# EAGLE design TSAL_mainboard (EAGLE 9.6.2)
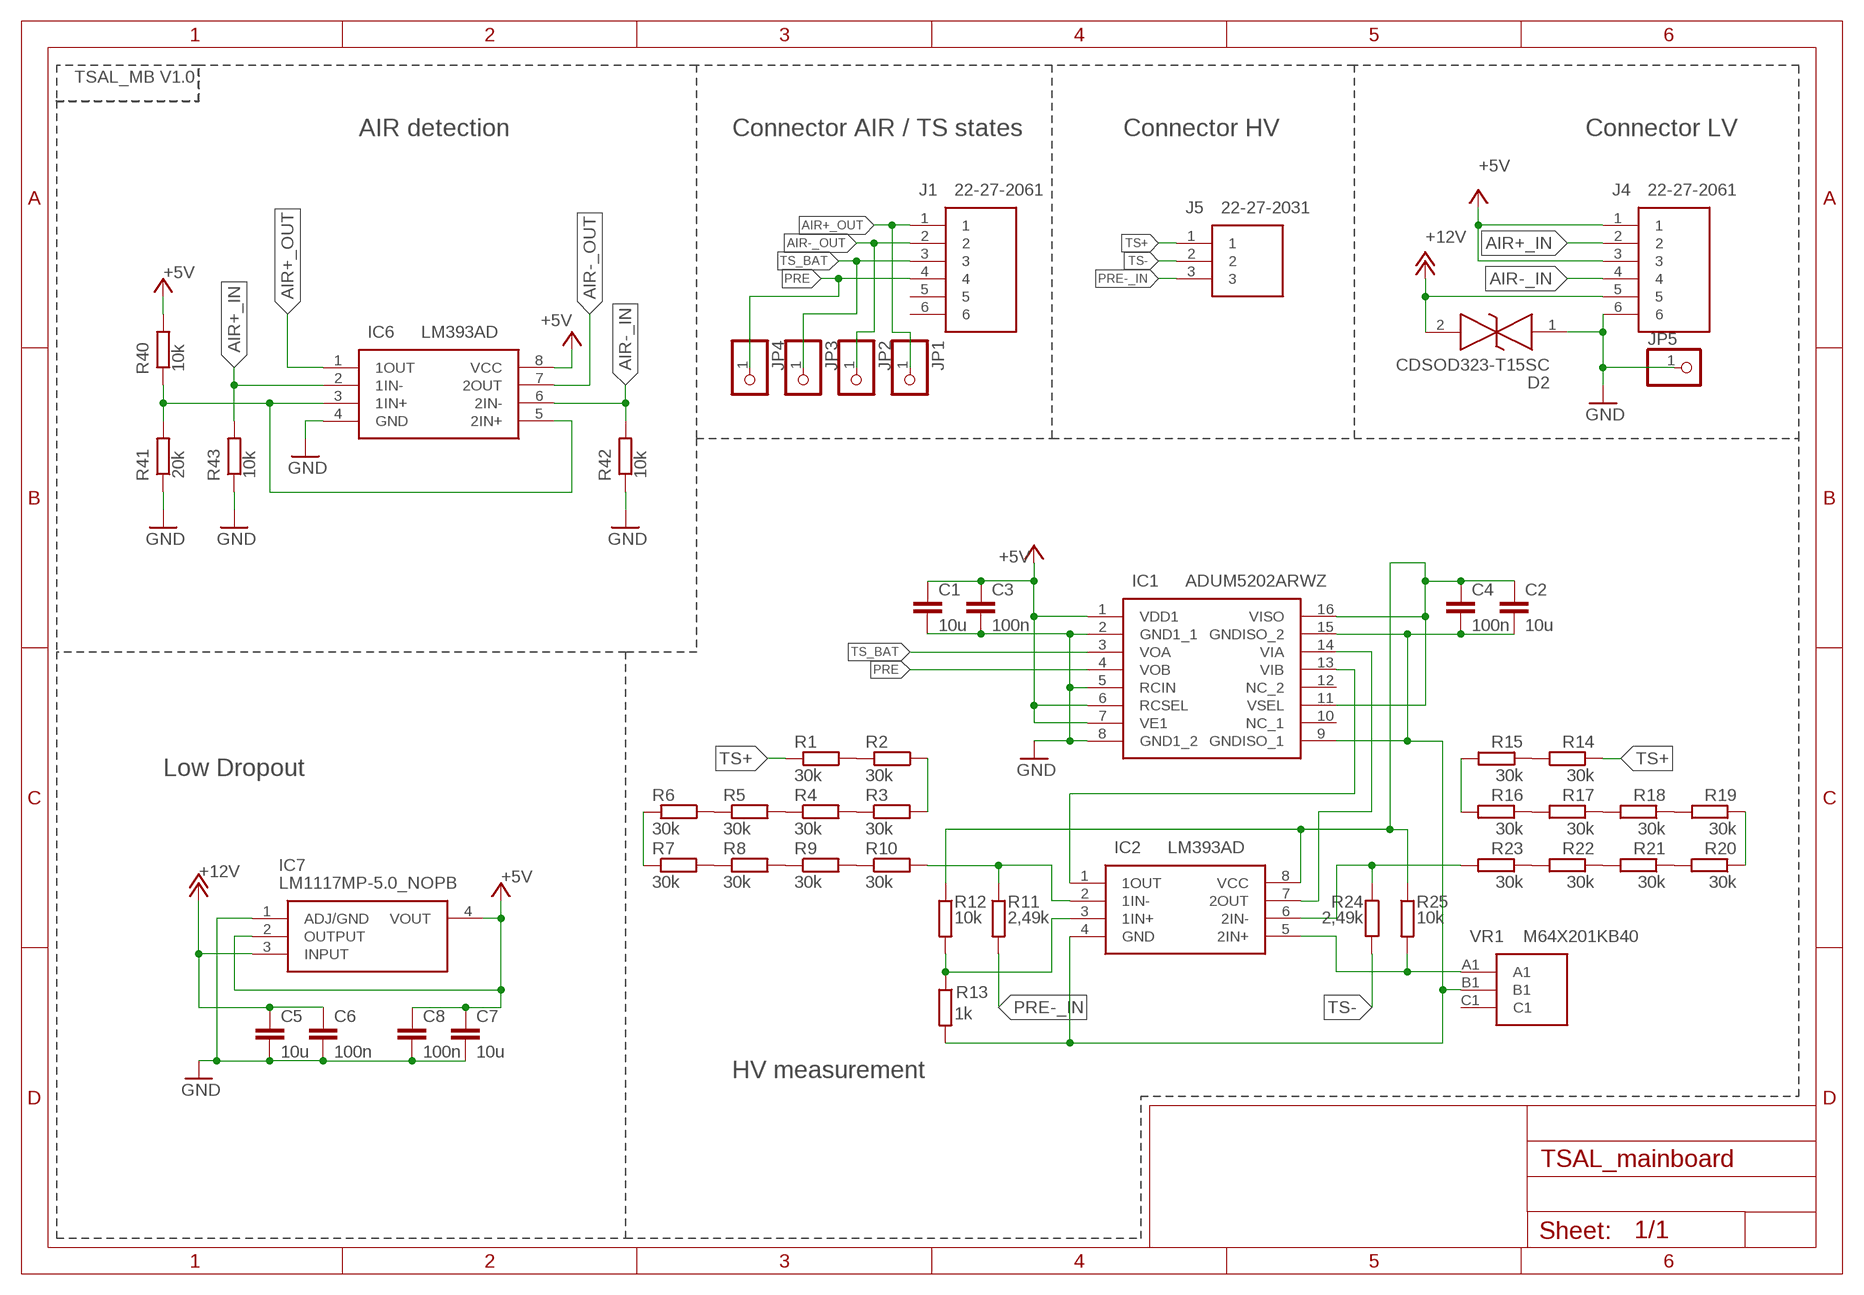
[diagram p0: schematic, sheet 1]

## Parts
C1  10u  C-EUC1206  [C1206]
C2  10u  C-EUC1206  [C1206]
C3  100n  C-EUC0603  [C0603]
C4  100n  C-EUC0603  [C0603]
C5  10u  C-EUC1206  [C1206]
C6  100n  C-EUC0603  [C0603]
C7  10u  C-EUC1206  [C1206]
C8  100n  C-EUC0603  [C0603]
D2  CDSOD323-T15SC  [SOD-323]
IC1  ADUM5202ARWZ  [SOIC127P1032X265-16N]
IC2  LM393AD  [SOIC127P600X175-8N]
IC6  LM393AD  [SOIC127P600X175-8N]
IC7  LM1117MP-5.0_NOPB  [SOT230P700X180-4N]
J1  22-27-2061  [HDRV6W64P0X254_1X6_1524X580X11]
J4  22-27-2061  [HDRV6W64P0X254_1X6_1524X580X11]
J5  22-27-2031  [SHDR3W64P0X254_1X3_762X580X111]
JP1  PINHD-1X1  [1X01]
JP2  PINHD-1X1  [1X01]
JP3  PINHD-1X1  [1X01]
JP4  PINHD-1X1  [1X01]
JP5  PINHD-1X1  [1X01]
R1  30k  R-EU_R1206  [R1206]
R2  30k  R-EU_R1206  [R1206]
R3  30k  R-EU_R1206  [R1206]
R4  30k  R-EU_R1206  [R1206]
R5  30k  R-EU_R1206  [R1206]
R6  30k  R-EU_R1206  [R1206]
R7  30k  R-EU_R1206  [R1206]
R8  30k  R-EU_R1206  [R1206]
R9  30k  R-EU_R1206  [R1206]
R10  30k  R-EU_R1206  [R1206]
R11  2,49k  R-EU_R0603  [R0603]
R12  10k  R-EU_R0603  [R0603]
R13  1k  R-EU_R1206  [R1206]
R14  30k  R-EU_R1206  [R1206]
R15  30k  R-EU_R1206  [R1206]
R16  30k  R-EU_R1206  [R1206]
R17  30k  R-EU_R1206  [R1206]
R18  30k  R-EU_R1206  [R1206]
R19  30k  R-EU_R1206  [R1206]
R20  30k  R-EU_R1206  [R1206]
R21  30k  R-EU_R1206  [R1206]
R22  30k  R-EU_R1206  [R1206]
R23  30k  R-EU_R1206  [R1206]
R24  2,49k  R-EU_R0603  [R0603]
R25  10k  R-EU_R0603  [R0603]
R40  10k  R-EU_R0603  [R0603]
R41  20k  R-EU_R0603  [R0603]
R42  10k  R-EU_R0603  [R0603]
R43  10k  R-EU_R0603  [R0603]
VR1  M64X201KB40  [M64X201KB40]

## Nets
+5V [5V]: C1.1 C3.1 C7.1 C8.1 IC1.1(VDD1) IC1.6(RCSEL) IC1.7(VE1) IC6.8(VCC) IC7.2(OUTPUT) IC7.4(VOUT) J4.1 J4.3 R40.2
+12V [12V]: C5.1 C6.1 D2.2 IC7.3(INPUT) J4.5
AIR+_IN [5V]: IC6.2(1IN-) J4.2 R43.2
AIR+_OUT [5V]: IC6.1(1OUT) J1.1 JP1.1
AIR-_IN [5V]: IC6.6(2IN-) J4.4 R42.2
AIR-_OUT [5V]: IC6.7(2OUT) J1.2 JP2.1
GND [GROUND]: C1.2 C3.2 C5.2 C6.2 C7.2 C8.2 D2.1 IC1.2(GND1_1) IC1.5(RCIN) IC1.8(GND1_2) IC6.4(GND) IC7.1(ADJ/GND) J4.6 JP5.1 R41.1 R42.1 R43.1
N$2 [5V]: C2.1 C4.1 IC1.11(VSEL) IC1.16(VISO) IC2.8(VCC) R12.1 R25.1
N$3 [30V]: R1.1 R2.2
N$4 [30V]: R2.1 R3.2
N$5 [30V]: R3.1 R4.2
N$6 [30V]: R4.1 R5.2
N$7 [30V]: R6.2 R7.1
N$8 [30V]: R7.2 R8.1
N$9 [30V]: R8.2 R9.1
N$10 [30V]: R9.2 R10.1
N$11 [30V]: R5.1 R6.1
N$12 [30V]: IC2.2(1IN-) R10.2 R11.1
N$13 [5V]: IC2.3(1IN+) R12.2 R13.1
N$14 [30V]: R14.1 R15.2
N$15 [30V]: R15.1 R16.2
N$16 [30V]: R16.1 R17.2
N$17 [30V]: R17.1 R18.2
N$18 [30V]: R19.2 R20.1
N$19 [30V]: R20.2 R21.1
N$20 [30V]: R21.2 R22.1
N$21 [30V]: R22.2 R23.1
N$22 [30V]: R18.1 R19.1
N$23 [30V]: IC2.6(2IN-) R23.2 R24.1
N$24 [5V]: IC1.13(VIB) IC2.1(1OUT)
N$25 [5V]: IC2.5(2IN+) R25.2 VR1.A1
N$28 [5V]: IC1.14(VIA) IC2.7(2OUT)
N$29 [5V]: IC6.3(1IN+) IC6.5(2IN+) R40.1 R41.2
N$70 [5V]: C2.2 C4.2 IC1.9(GNDISO_1) IC1.15(GNDISO_2) IC2.4(GND) R13.2 VR1.B1
PRE [5V]: IC1.4(VOB) J1.4 JP4.1
PRE-_IN [30V]: J5.3 R11.2
TS+ [30V]: J5.1 R1.2 R14.2
TS- [30V]: J5.2 R24.2
TS_BAT [5V]: IC1.3(VOA) J1.3 JP3.1
Unconnected: IC1.10(NC_1) IC1.12(NC_2) J1.5 J1.6 VR1.C1

## Notes on the sheet
- TSAL_MB V1.0
- AIR detection | Connector AIR / TS states | Connector HV | Connector LV
- Low Dropout
- HV measurement

## Library data of the parts
C1-C8 = rcl:C-EU: CAPACITOR, European symbol; SPICEPREFIX: C
D2 = SamacSys_Parts:CDSOD323-T15SC: TVS Diode ESD 15V BiDirectional SOD323 Bourns CDSOD323-T15SC Bi-Directional TVS Diode, 400W peak, 2-Pin SOD-323 Source: Datasheet <http://uk.rs-online.com/web/p/products/7734570>; ALLIED_NUMBER: 70410859; DESCRIPTION: TVS Diode ESD 15V BiDirectional SOD323 Bourns CDSOD323-T15SC Bi-Directional TVS Diode, 400W peak, 2-Pin SOD-323; HEIGHT: mm; MANUFACTURER_NAME: Bourns; MANUFACTURER_PART_NUMBER: CDSOD323-T15SC; RS_PART_NUMBER: 7734570; RS_PRICE-STOCK: http://uk.rs-online.com/web/p/products/7734570
IC1 = SamacSys_Parts:ADUM5202ARWZ: Digital Isolator 2-channel SOIC16 Source: Datasheet <http://docs-emea.rs-online.com/webdocs/0e48/0900766b80e48186.pdf>; ARROW_PART_NUMBER: ADUM5202ARWZ; ARROW_PRICE-STOCK: https://www.arrow.com/en/products/adum5202arwz/analog-devices; DESCRIPTION: Digital Isolator 2-channel SOIC16; HEIGHT: 2.65mm; MANUFACTURER_NAME: Analog Devices; MANUFACTURER_PART_NUMBER: ADUM5202ARWZ; MOUSER_PART_NUMBER: 584-ADUM5202ARWZ; MOUSER_PRICE-STOCK: https://www.mouser.com/Search/Refine.aspx?Keyword=584-ADUM5202ARWZ
IC2 IC6 = SamacSys_Parts:LM393AD: LM393ADG4, Dual Comparator Open Collector 1.3s 2-kanalers 3, 5, 9, 12, 15, 18, 24, 28V 8-Pin SOIC Source: Datasheet <http://uk.rs-online.com/web/p/products/5171905P>; DESCRIPTION: LM393ADG4, Dual Comparator Open Collector 1.3s 2-kanalers 3, 5, 9, 12, 15, 18, 24, 28V 8-Pin SOIC; HEIGHT: 1.75mm; MANUFACTURER_NAME: Texas Instruments; MANUFACTURER_PART_NUMBER: LM393AD; RS_PART_NUMBER: 5171905P; RS_PRICE-STOCK: http://uk.rs-online.com/web/p/products/5171905P
IC7 = SamacSys_Parts:LM1117MP-5.0_NOPB: LM1117MP-5.0/NOPB, Low Dropout Voltage Regulator, 1.5A, 5 V +/-1%, 4-Pin SOT-223 Source: Datasheet <https://datasheet.datasheetarchive.com/originals/distributors/Datasheets-SFU2/DSASFU100036103.pdf>; ARROW_PART_NUMBER: LM1117MP-5.0/NOPB; ARROW_PRICE-STOCK: https://www.arrow.com/en/products/lm1117mp-5.0nopb/texas-instruments?region=nac; DESCRIPTION: LM1117MP-5.0/NOPB, Low Dropout Voltage Regulator, 1.5A, 5 V +/-1%, 4-Pin SOT-223; HEIGHT: 1.8mm; MANUFACTURER_NAME: Texas Instruments; MANUFACTURER_PART_NUMBER: LM1117MP-5.0/NOPB; MOUSER_PART_NUMBER: 926-LM1117MP-5.0NOPB; MOUSER_PRICE-STOCK: https://www.mouser.co.uk/ProductDetail/Texas-Instruments/LM1117MP-50-NOPB?qs=X1J7HmVL2ZFGlzwnAaPsKg%3D%3D
J1 J4 = SamacSys_Parts:22-27-2061: 6way straight PCB header w/friction lock Molex KK Series, Series Number 6410, 2.54mm Pitch 6 Way 1 Row Straight PCB Header, Solder Termination, 4A Source: Datasheet <http://uk.rs-online.com/web/p/products/4838506P>; DESCRIPTION: 6way straight PCB header w/friction lock Molex KK Series, Series Number 6410, 2.54mm Pitch 6 Way 1 Row Straight PCB Header, Solder Termination, 4A; HEIGHT: 11.7mm; MANUFACTURER_NAME: Molex; MANUFACTURER_PART_NUMBER: 22-27-2061; RS_PART_NUMBER: 4838506P; RS_PRICE-STOCK: http://uk.rs-online.com/web/p/products/4838506P
J5 = SamacSys_Parts:22-27-2031: 3way straight PCB header w/friction lock Molex KK Series, Series Number 6410, 2.54mm Pitch 3 Way 1 Row Straight PCB Header, Solder Termination, 4A Source: Datasheet <http://uk.rs-online.com/web/p/products/4838477P>; ALLIED_NUMBER: 70190935; DESCRIPTION: 3way straight PCB header w/friction lock Molex KK Series, Series Number 6410, 2.54mm Pitch 3 Way 1 Row Straight PCB Header, Solder Termination, 4A; HEIGHT: 11.18mm; MANUFACTURER_NAME: Molex; MANUFACTURER_PART_NUMBER: 22-27-2031; RS_PART_NUMBER: 4838477P; RS_PRICE-STOCK: http://uk.rs-online.com/web/p/products/4838477P
JP1-JP5 = pinhead:PINHD-1X1: PIN HEADER
R1-R25 R40-R43 = rcl:R-EU_: RESISTOR, European symbol; SPICEPREFIX: R
VR1 = SamacSys_Parts:M64X201KB40: Trimmer Resistors - Through Hole 3/8"SQ 200ohms Multi Turn Cermet Source: Datasheet <https://www.mouser.co.uk/datasheet/2/427/64-239937.pdf>; ARROW_PART_NUMBER: M64X201KB40; ARROW_PRICE-STOCK: https://www.arrow.com/en/products/m64x201kb40/vishay; DESCRIPTION: Trimmer Resistors - Through Hole 3/8"SQ 200ohms Multi Turn Cermet; HEIGHT: 9.8mm; MANUFACTURER_NAME: Vishay; MANUFACTURER_PART_NUMBER: M64X201KB40; MOUSER_PART_NUMBER: 594-64X201; MOUSER_PRICE-STOCK: https://www.mouser.com/Search/Refine.aspx?Keyword=594-64X201

## Net classes
1 GROUND: width 0.5 mm, drill 0.401 mm, clearance 0.051 mm
2 12V: width 0.5 mm, drill 0.401 mm, clearance 0.051 mm
3 30V: width 0.8 mm, drill 0.401 mm, clearance 0.051 mm
4 5V: width 0.3 mm, drill 0.401 mm, clearance 0.051 mm

## Board
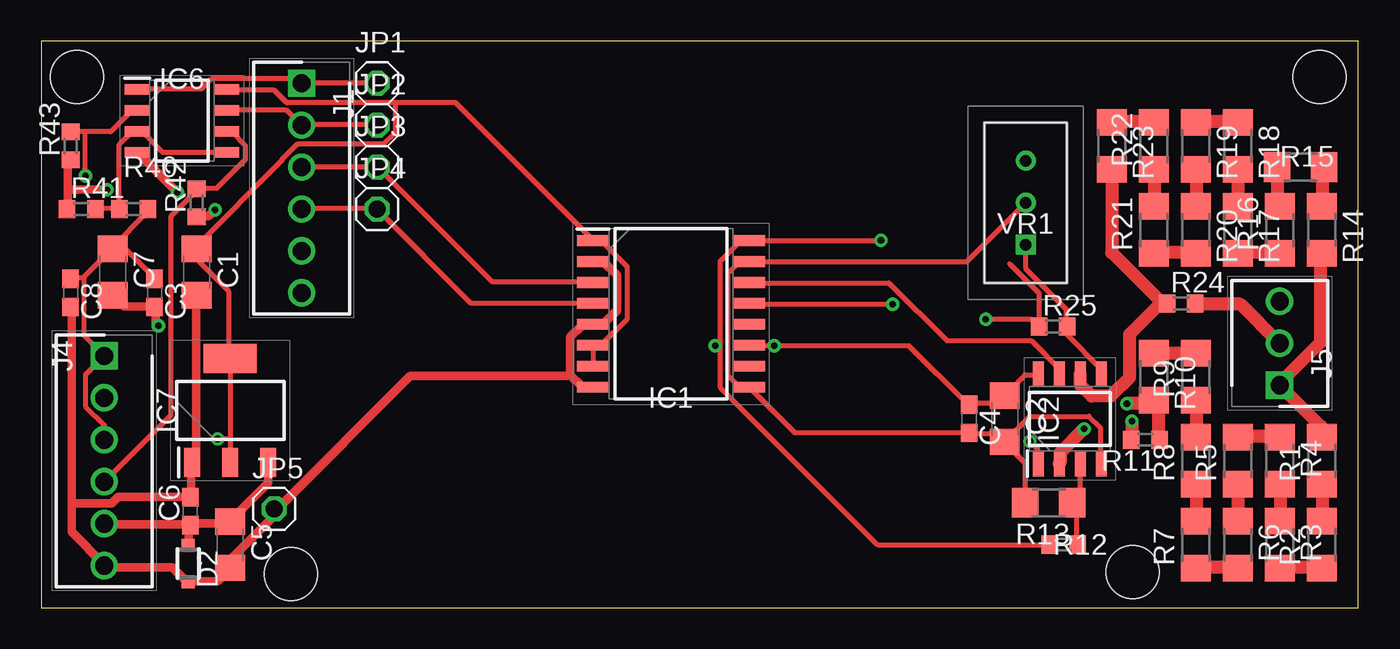
[diagram p1: board, top side]
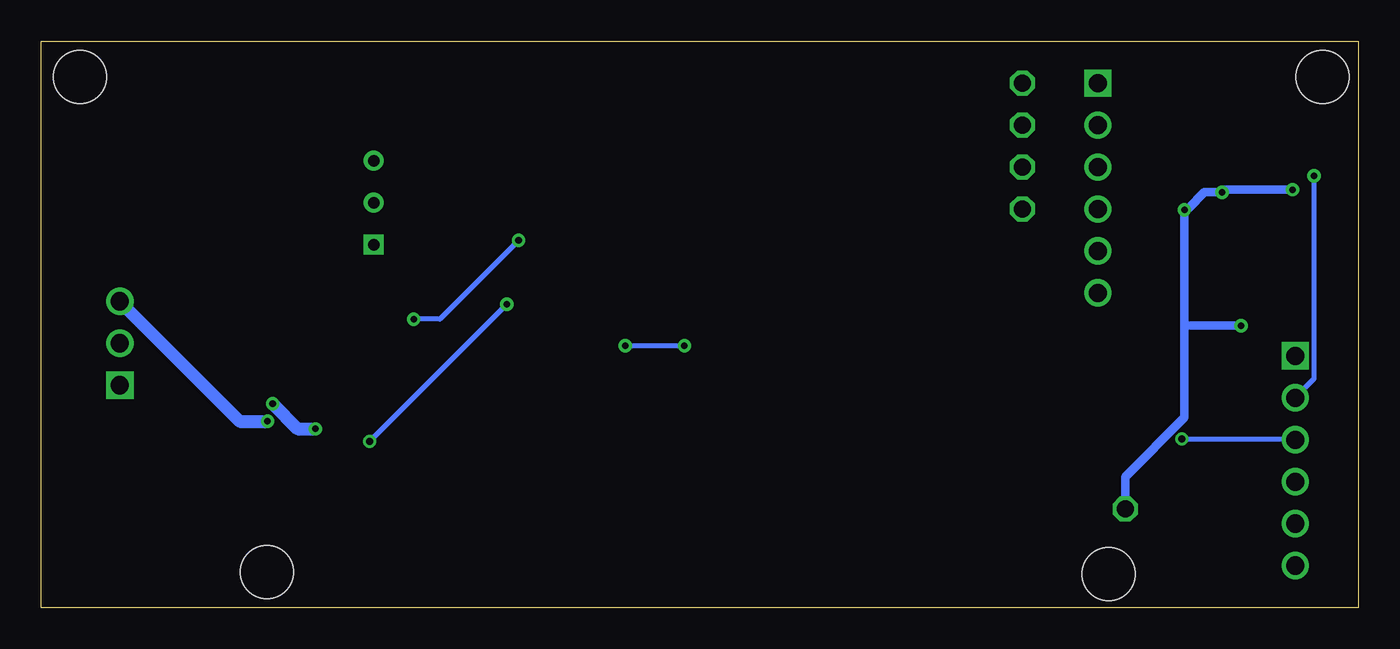
[diagram p2: board, bottom side, seen from below]

Size 79.68 x 34.28 mm. Coordinates in mm from the lower left corner, seen from the top.
Outline: 0,0 79.68,0 79.68,34.28 0,34.28 0,0
Copper layers (1*16): Top 0.035mm / dielectric 1.5mm / Bottom 0.035mm
Design rules "default": minimum track width 6mil, minimum drill 0.35mm, track to track 6mil, track to pad 6mil, pad to pad 6mil, via to via 6mil, smd to smd 6mil, copper to edge 40mil, drill to drill 6mil, minimum pad ring 10mil, minimum via ring 8mil, stop-mask expansion 4mil, vias tented up to drill 0mil, thermal gap 10mil
Holes 3.2 mm at 2.16,32.13 15.11,2.03 77.34,32.13 66.04,2.16

### Footprints (pad centres in the part's own frame; a part is rotated, then mirrored left to right if it is on the bottom)
C1206 = smd 1.6 x 1.8: 1 -1.4,0; 2 1.4,0
C0603 = smd 1.1 x 1: 1 -0.85,0; 2 0.85,0
SOD-323 = smd 0.8 x 0.8: 1 -1.1,0; 2 1.1,0
SOIC127P1032X265-16N = smd 1.925 x 0.65: 1 -4.712,4.445; 2 -4.712,3.175; 3 -4.712,1.905; 4 -4.712,0.635; 5 -4.712,-0.635; 6 -4.712,-1.905; 7 -4.712,-3.175; 8 -4.712,-4.445; 9 4.712,-4.445; 10 4.712,-3.175; 11 4.712,-1.905; 12 4.712,-0.635; 13 4.712,0.635; 14 4.712,1.905; 15 4.712,3.175; 16 4.712,4.445
SOIC127P600X175-8N = smd 1.528 x 0.65: 1 -2.711,1.905; 2 -2.711,0.635; 3 -2.711,-0.635; 4 -2.711,-1.905; 5 2.711,-1.905; 6 2.711,-0.635; 7 2.711,0.635; 8 2.711,1.905
SOT230P700X180-4N = smd 1.75 x 0.95: 1 -3.15,2.3; 2 -3.15,0; 3 -3.15,-2.3 | smd 1.75 x 3.2: 4 3.15,0
HDRV6W64P0X254_1X6_1524X580X11 = drill 1.1 pad 1.65 square: 1 0,0 | drill 1.1 pad 1.65: 2 2.54,0; 3 5.08,0; 4 7.62,0; 5 10.16,0; 6 12.7,0
SHDR3W64P0X254_1X3_762X580X111 = drill 1.1 pad 1.65 square: 1 0,0 | drill 1.1 pad 1.65: 2 -2.54,0; 3 -5.08,0
1X01 = drill 1.016 octagon: 1 0,0
R1206 = smd 1.6 x 1.803: 1 -1.422,0; 2 1.422,0
R0603 = smd 1 x 1.1: 1 -0.85,0; 2 0.85,0
M64X201KB40 = drill 0.7 pad 1.2 square: A1 0,0 | drill 0.7 pad 1.2: B1 0,-2.54; C1 0,-5.08

### Placement (x,y rotation side)
C1  9.4,20.32 270 top
C2  58.29,11.43 270 top
C3  6.86,19.05 270 top
C4  56.13,11.43 270 top
C5  11.43,3.81 270 top
C6  9.02,5.84 90 top
C7  4.32,20.32 270 top
C8  1.78,19.05 270 top
D2  8.89,2.67 90 top
IC1  38.1,17.78 0 top
IC2  62.23,11.43 90 top
IC6  8.51,29.46 0 top
IC7  11.43,11.94 90 top
J1  15.75,31.75 270 top
J4  3.81,15.24 270 top
J5  74.93,13.46 270 top
JP1  20.32,31.75 0 top
JP2  20.32,29.21 0 top
JP3  20.32,26.67 0 top
JP4  20.32,24.13 0 top
JP5  14.1,5.97 0 top
R1  77.47,8.89 90 top
R2  77.47,3.81 90 top
R3  74.93,3.81 270 top
R4  74.93,8.89 270 top
R5  72.39,8.89 90 top
R6  72.39,3.81 270 top
R7  69.85,3.81 90 top
R8  69.85,8.89 90 top
R9  69.85,13.97 90 top
R10  67.31,13.97 270 top
R11  66.8,10.16 180 top
R12  61.85,3.81 0 top
R13  60.96,6.35 180 top
R14  77.47,22.86 270 top
R15  76.2,26.67 0 top
R16  74.93,22.86 90 top
R17  72.39,22.86 270 top
R18  72.39,27.94 270 top
R19  69.85,27.94 270 top
R20  69.85,22.86 270 top
R21  67.31,22.86 90 top
R22  67.31,27.94 90 top
R23  64.77,27.94 270 top
R24  68.96,18.41 0 top
R25  61.21,17.02 0 top
R40  5.59,24.13 0 top
R41  2.41,24.13 0 top
R42  9.4,24.51 90 top
R43  1.78,27.94 90 top
VR1  59.56,21.97 180 top

### Tracks (layer width: path | path; a pad name or v marks a point on that pad's centre or on a via)
+5V  (via drill 0.4)
  Top 0.3: 2.52,19.96 1.83,19.96 C8.1 | 2.52,19.96 4.27,21.72 C7.1 | R40.2 6.4,24.08 6.4,23.93 4.34,21.87 C7.1 | C3.1 6.86,19.96 4.72,22.1 C7.1 | J4.3 3.81,11.05 2.67,12.19 2.67,14.1 J4.1 2.59,16.46 2.59,19.89 2.52,19.96 | 11.43,10.21 IC7.4 11.35,15.16 11.35,19.13 9.45,21.03 9.45,21.72 C1.1 9.37,21.87 14.55,27.05 14.55,27.13 15.47,28.04 20.73,28.04 21.41,28.73 21.41,30.56 | 11.43,10.21 IC7.2 | IC1.7 33.38,14.63 33.38,15.85 IC1.6 33.53,15.93 33.91,15.93 35.43,17.45 35.43,20.65 33.91,22.17 33.53,22.17 IC1.1 33.38,22.25 25.07,30.56 21.41,30.56 | 21.41,30.56 14.86,30.56 14.1,31.32 11.28,31.32 IC6.8 | 11.43,10.21 v10.67,10.21
  Bottom 0.3: v10.67,10.21 3.81,10.21 J4.3
+12V
  Top 0.5: D2.2 8.91,3.81 8.91,4.88 8.99,4.95 C6.1 | C6.1 9.22,5.11 11.35,5.11 11.43,5.18 C5.1 11.58,5.41 13.72,7.54 13.72,8.76 IC7.3 | J4.5 3.81,5.03 8.76,5.03 C6.1
AIR+_IN  (via drill 0.4)
  Top 0.3: 2.67,28.8 4.19,28.8 5.49,30.1 IC6.2 | 2.67,28.8 1.83,28.8 R43.2 | v2.67,26.14 2.67,28.8
  Bottom 0.3: v2.67,26.14 2.67,13.87 3.81,12.72 J4.2
AIR+_OUT
  Top 0.3: IC6.1 5.87,31.39 9.68,31.39 10.29,32 15.47,32 15.7,31.77 J1.1 15.85,31.77 20.27,31.77 JP1.1
AIR-_IN
  Top 0.3: IC6.6 11.28,28.8 11.51,28.8 12.34,27.96 12.34,27.13 10.59,25.38 9.45,25.38 R42.2 9.37,25.22 7.85,23.7 7.85,11.66 J4.4
AIR-_OUT
  Top 0.3: IC6.7 14.86,30.1 J1.2 15.85,29.26 20.27,29.26 JP2.1
GND  (via drill 0.4)
  Top 0.5: C1.2 9.37,18.9 9.37,9.14 9.22,8.99 IC7.1 9.07,8.76 9.07,6.71 C6.2 8.76,6.71 4.65,6.71 4.27,6.33 1.83,6.33 | 1.83,6.33 1.83,4.57 3.81,2.59 J4.6 4.04,2.44 7.92,2.44 8.69,1.68 D2.1 8.91,1.6 10.67,1.6 11.43,2.36 C5.2 11.58,2.59 11.58,3.05 14.1,5.56 JP5.1 14.33,6.02 22.33,14.02 31.77,14.02 32,14.1 | 1.83,6.33 1.83,18.14 C8.2 | IC1.8 32.77,13.34 32,14.1 | 32,14.1 32,16.38 32.77,17.14 IC1.5 33.6,17.22 34.06,17.22 34.82,17.98 34.82,20.12 33.98,20.95 IC1.2 | C7.2 4.34,18.9 5.03,18.21 6.86,18.21 C3.2 6.93,17.98 6.93,17.22 v7.09,17.07 | 1.6,25.3 1.6,26.9 1.75,27.05 R43.1 | 1.6,25.3 1.6,24.16 R41.1 | v10.52,24.08 10.13,23.7 9.45,23.7 R42.1 | v8.23,25.15 5.87,27.51 IC6.4 | v3.96,25.3 1.6,25.3
  Bottom 0.5: 10.52,17.07 10.52,11.51 14.1,7.92 JP5.1 | 10.52,17.07 v10.52,24.08 10.29,24.16 9.3,25.15 v8.23,25.15 8.08,25.3 v3.96,25.3 | 10.52,17.07 v7.09,17.07
N$2  (via drill 0.4)
  Top 0.3: IC2.8 60.27,14.1 59.51,14.1 58.37,12.95 C2.1 58.29,12.8 57.84,12.34 56.16,12.34 C4.1 56.01,12.34 52.5,15.85 v44.35,15.85 42.82,15.85 IC1.11 | R12.1 50.6,3.81 41.07,13.34 41.07,15.85 | 41.07,15.85 41.07,20.95 42.29,22.17 42.75,22.17 IC1.16 | 60.35,17.07 60.35,19.05 58.6,20.8 | 60.35,17.07 R25.1 | 42.9,22.33 IC1.16 | 41.07,15.85 v40.77,15.85 | IC1.16 v50.8,22.23 | v57.15,17.46 59.96,17.46 60.35,17.07
  Bottom 0.3: v40.77,15.85 v44.35,15.85 | v50.8,22.23 55.56,17.46 v57.15,17.46
N$3
  Top 0.8: R2.2 77.5,5.26 77.5,7.47 R1.1
N$4
  Top 0.8: R3.2 74.98,2.44 77.42,2.44 R2.1
N$5
  Top 0.8: R3.1 74.98,5.26 74.98,7.47 R4.2
N$6
  Top 0.8: R5.2 72.39,10.36 74.91,10.36 R4.1
N$7
  Top 0.8: R7.1 69.88,2.44 72.39,2.44 R6.2
N$8
  Top 0.8: R7.2 69.88,5.26 69.88,7.47 R8.1
N$9
  Top 0.8: R8.2 69.88,10.36 69.88,12.5 R9.1
N$10
  Top 0.8: R10.1 67.36,15.39 69.8,15.39 R9.2
N$11
  Top 0.8: R5.1 R6.1
N$12  (via drill 0.4)
  Top 0.8: R11.1 67.59,10.21 67.59,12.27 67.36,12.5 R10.2 66.98,12.34 v65.68,12.34 | v63.09,10.82 61.65,9.37 61.65,8.76 IC2.2
  Bottom 0.8: v63.09,10.82 64.16,10.82 v65.68,12.34
N$13
  Top 0.3: R12.2 62.64,3.81 62.64,6.1 62.41,6.33 R13.1 62.41,6.48 62.87,6.93 IC2.3
N$14
  Top 0.8: R14.1 77.5,24.31 77.5,26.59 77.57,26.67 R15.2
N$15
  Top 0.8: R15.1 74.83,26.67 74.83,24.38 74.91,24.31 R16.2
N$16
  Top 0.8: R17.2 72.39,21.49 74.91,21.49 R16.1
N$17
  Top 0.8: R18.2 R17.1
N$18
  Top 0.8: R20.1 69.88,24.31 69.88,26.52 R19.2
N$19
  Top 0.8: R21.1 67.36,21.49 69.8,21.49 R20.2
N$20
  Top 0.8: R21.2 67.36,24.31 67.36,26.52 R22.1
N$21
  Top 0.8: R23.1 64.77,29.41 67.28,29.41 R22.2
N$22
  Top 0.8: R19.1 69.88,29.41 72.39,29.41 R18.1
N$23
  Top 0.8: 67.82,18.44 68.05,18.44 R24.1 | 67.82,18.44 64.77,21.49 R23.2 | IC2.6 62.87,13.49 63.55,12.8 64.69,12.8 65.84,13.95 65.84,16.54 67.51,18.21 67.82,18.44
N$24  (via drill 0.4)
  Top 0.3: v59.82,10.06 60.27,9.6 60.27,8.76 IC2.1 | v51.51,18.36 42.82,18.36 IC1.13
  Bottom 0.3: v51.51,18.36 v59.82,10.06
N$25
  Top 0.3: IC2.5 64.08,14.17 64.08,14.48 62.1,16.46 62.1,16.99 R25.2 62.03,17.14 62.03,18.06 59.59,20.5 59.59,21.95 VR1.A1
N$28
  Top 0.3: IC2.7 61.57,14.17 61.57,14.48 59.89,16.15 54.79,16.15 51.28,19.66 42.82,19.66 IC1.14
N$29
  Top 0.3: R41.2 3.28,24.16 4.72,24.16 R40.1 4.72,24.31 4.72,28.04 5.49,28.8 5.79,28.8 IC6.3 5.94,28.8 6.1,28.8 7.32,27.58 11.2,27.58 IC6.5
N$70
  Top 0.3: C2.2 58.29,10.06 57.84,10.52 56.16,10.52 C4.2 56.01,10.59 45.57,10.59 42.9,13.26 IC1.9 42.29,13.34 41.53,14.1 41.53,20.19 42.29,20.95 IC1.15 | IC2.4 64.08,8.76 64.08,10.9 63.4,11.58 59.82,11.58 58.37,10.13 C2.2 | R13.2 59.51,6.4 59.51,8.76 58.37,9.91 C2.2 | 43.36,21.03 42.9,21.03 IC1.15 | IC1.15 56.01,20.95 VR1.B1
PRE
  Top 0.3: IC1.4 33.38,18.44 25.98,18.44 20.34,24.08 JP4.1 20.19,24.16 15.77,24.16 J1.4
PRE-_IN  (via drill 0.4)
  Top 0.8: v65.99,11.28 65.99,10.21 R11.2
  Bottom 0.8: v65.99,11.28 67.67,11.28 J5.3
TS+
  Top 0.8: R1.2 77.42,10.36 77.42,10.97 J5.1 75.13,13.79 77.42,16.08 77.42,21.41 R14.2
TS-
  Top 0.8: R24.2 69.88,18.36 72.54,18.36 74.91,16 J5.2
TS_BAT
  Top 0.3: IC1.3 33.38,19.74 27.28,19.74 20.34,26.67 JP3.1 J1.3